# EAGLE design RatDBS-TrackBattery (EAGLE 8.2.2)
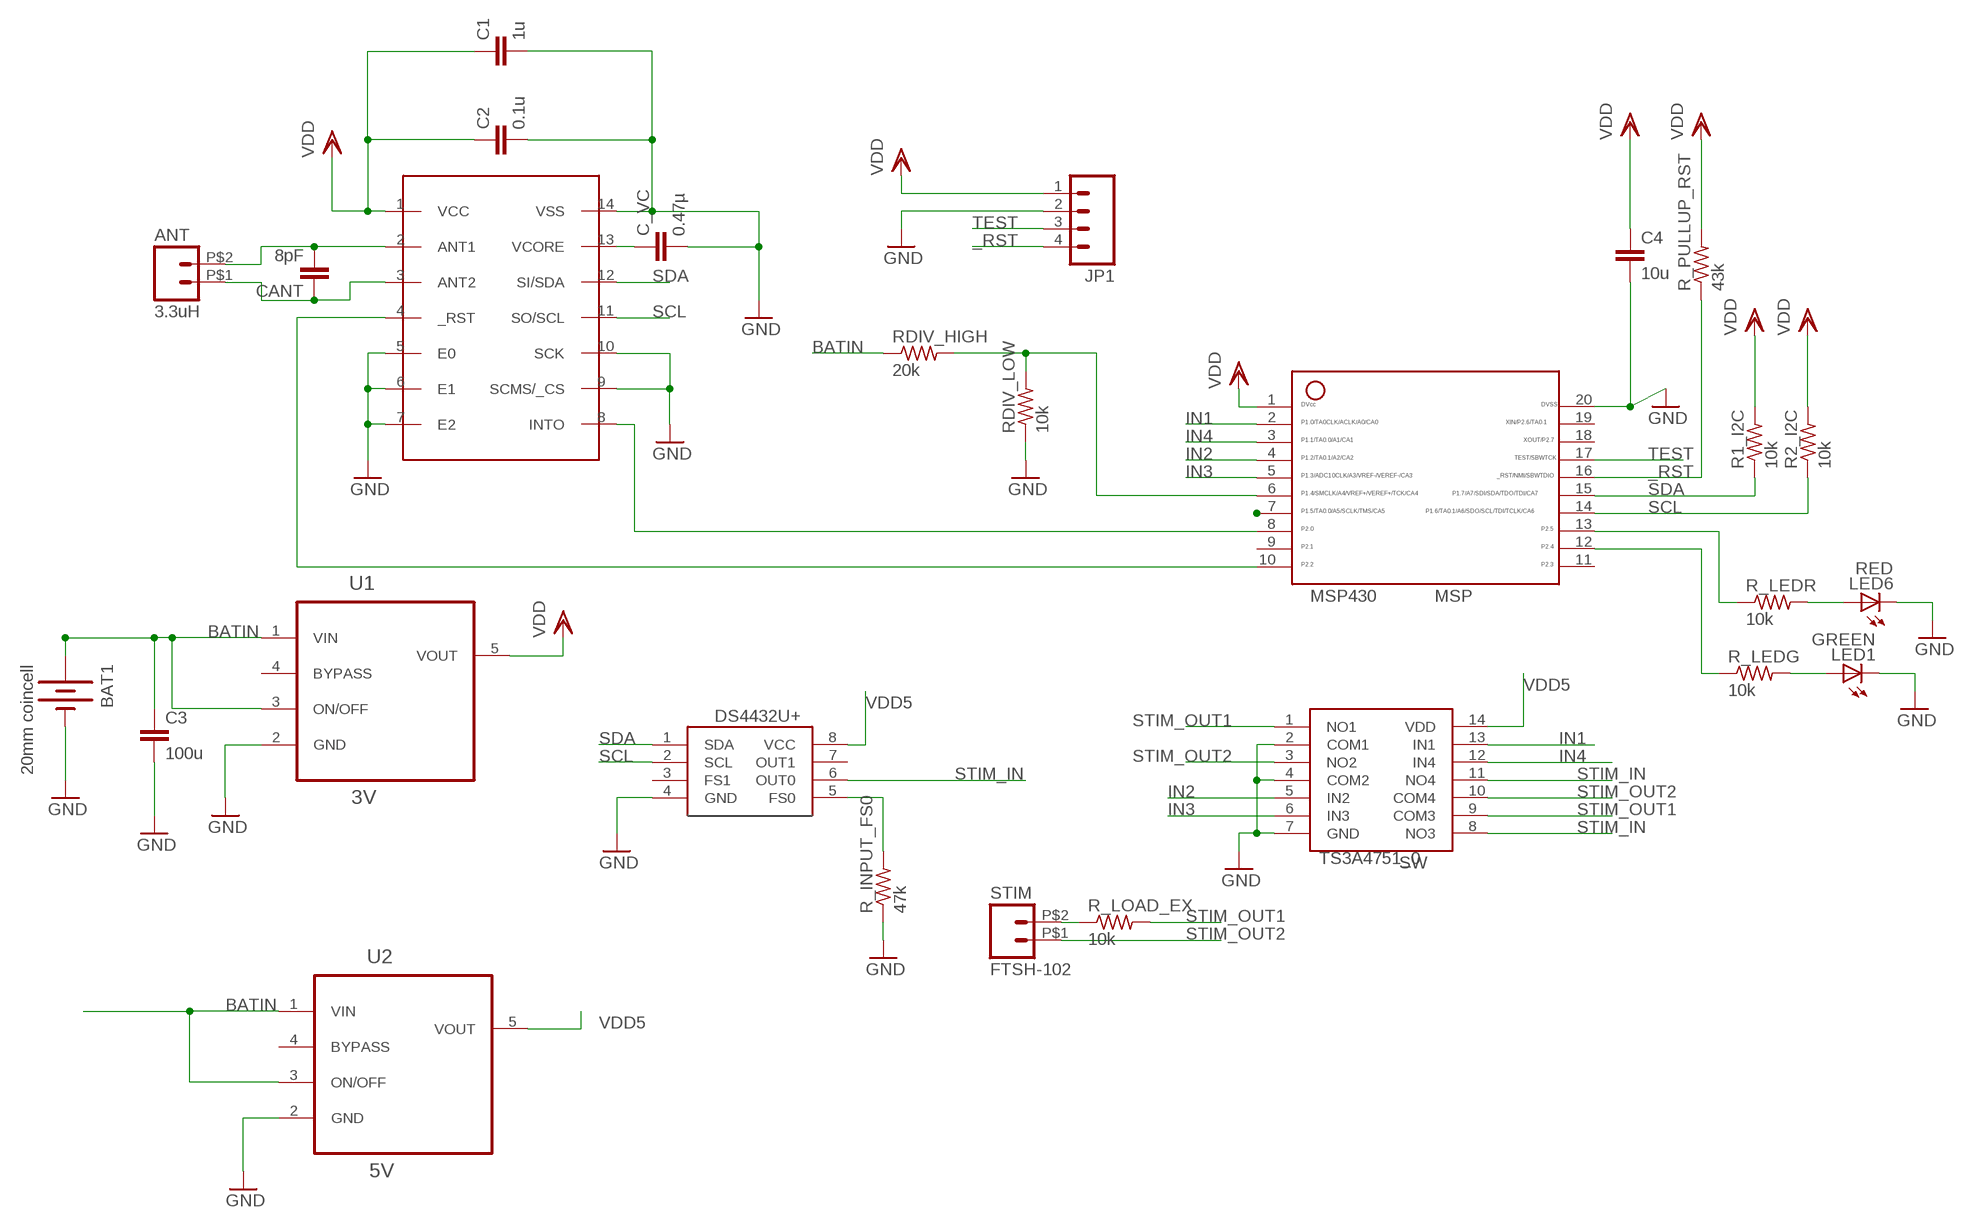
[diagram p0: schematic, sheet 1]

## Parts
ANT  3.3uH  FTSH-102  [FTSH-102-DH]
BAT1  20mm coincell  BATTERY  [BATTCOM_20MM_PLASTIC_STUDS]
C1  1u  C-EUC0603  [C0603]
C2  0.1u  C-EUC0603  [C0603]
C3  100u  C-EUC1206  [C1206]
C4  10u  C-EUC1206  [C1206]
C_VC  0.47µ  C-EUC0603  [C0603]
CANT  8pF  C-EUC0603  [C0603]
DS4432U+  DS4432U+  [8_PIN]
JP1  M041.27MM  [1X04-1.27MM]
LED1  GREEN  LED1206  [LED-1206]
LED6  RED  LED1206  [LED-1206]
MSP430  MSP  MSP430  [20_PIN]
R1_I2C  10k  R-US_R0603  [R0603]
R2_I2C  10k  R-US_R0603  [R0603]
R_INPUT_FS0  47k  R-US_R0603  [R0603]
R_LEDG  10k  R-US_R0603  [R0603]
R_LEDR  10k  R-US_R0603  [R0603]
R_LOAD_EX  10k  R-US_R0603  [R0603]
R_PULLUP_RST  43k  R-US_R0603  [R0603]
RDIV_HIGH  20k  R-US_R0603  [R0603]
RDIV_LOW  10k  R-US_R0603  [R0603]
STIM  FTSH-102  [FTSH-102-DH]
TS3A4751_0  SW  TS3A4751  [14_PIN]
U1  3V  LP2985A-33DBVTE4  [SOT95P280X145-5N]
U2  5V  LP2985A-33DBVTE4  [SOT95P280X145-5N]
U$1  NFC  RF430CL330H  [PW_R-PDSO-G14]

## Nets
_RST: JP1.4 MSP430.16 R_PULLUP_RST.1
BATIN: BAT1.1(+) C3.1 RDIV_HIGH.1 U1.1(VIN) U1.3(ON/OFF) U2.1(VIN) U2.3(ON/OFF)
GND: BAT1.2(-) C1.2 C2.2 C3.2 C4.2 C_VC.2 DS4432U+.4(GND) JP1.2 LED1.C LED6.C MSP430.20 R_INPUT_FS0.1 RDIV_LOW.1 TS3A4751_0.2(COM1) TS3A4751_0.4(COM2) TS3A4751_0.7(GND) U1.2(GND) U2.2(GND) U$1.5(E0) U$1.6(E1) U$1.7(E2) U$1.9(SCMS/_CS) U$1.10(SCK) U$1.14(VSS)
IN1: MSP430.2 TS3A4751_0.13(IN1)
IN2: MSP430.4 TS3A4751_0.5(IN2)
IN3: MSP430.5 TS3A4751_0.6(IN3)
IN4: MSP430.3 TS3A4751_0.12(IN4)
N$1: C_VC.1 U$1.13(VCORE)
N$2: ANT.P$2 CANT.2 U$1.2(ANT1)
N$3: MSP430.8 U$1.8(INTO)
N$4: R_LOAD_EX.1 STIM.P$2
N$5: MSP430.13 R_LEDR.1
N$6: MSP430.7
N$7: MSP430.10 U$1.4(_RST)
N$8: DS4432U+.5(FS0) R_INPUT_FS0.2
N$9: LED6.A R_LEDR.2
N$10: MSP430.6 RDIV_HIGH.2 RDIV_LOW.2
N$11: MSP430.12 R_LEDG.1
N$12: ANT.P$1 CANT.1 U$1.3(ANT2)
N$13: LED1.A R_LEDG.2
SCL: DS4432U+.2(SCL) MSP430.14 R2_I2C.1 U$1.11(SO/SCL)
SDA: DS4432U+.1(SDA) MSP430.15 R1_I2C.1 U$1.12(SI/SDA)
STIM_IN: DS4432U+.6(OUT0) TS3A4751_0.8(NO3) TS3A4751_0.11(NO4)
STIM_OUT1: R_LOAD_EX.2 TS3A4751_0.1(NO1) TS3A4751_0.9(COM3)
STIM_OUT2: STIM.P$1 TS3A4751_0.3(NO2) TS3A4751_0.10(COM4)
TEST: JP1.3 MSP430.17
VDD: C1.1 C2.1 C4.1 JP1.1 MSP430.1 R1_I2C.2 R2_I2C.2 R_PULLUP_RST.2 U1.5(VOUT) U$1.1(VCC)
VDD5: DS4432U+.8(VCC) TS3A4751_0.14(VDD) U2.5(VOUT)
Unconnected: DS4432U+.3(FS1) DS4432U+.7(OUT1) MSP430.9 MSP430.11 MSP430.18 MSP430.19 U1.4(BYPASS) U2.4(BYPASS)

## Library data of the parts
ANT STIM = Samtec50Mil:FTSH-102
BAT1 = Battery:BATTERY: Compact CR2032 Battery Holder SMT ground pad 20MM_4LEGS, Digikey: BAT-HLD-001-THM-OTL
C1-C4 C_VC CANT = rcl:C-EU: CAPACITOR, European symbol
DS4432U+ = RatDBS:DS4432U+: DS4432U+ current DAC
JP1 = SparkFun:M04: Header 4 Standard 4-pin 0.1" header. Use with straight break away headers (SKU : PRT-00116), right angle break away headers (PRT-00553), swiss pins (PRT-00743), machine pins (PRT-00117), and female headers (PRT-00115). Molex polarized connector foot print use with SKU : PRT-08231 with associated crimp pins and housings.
LED1 LED6 = SparkFun-LED:LED: LEDs Standard schematic elements and footprints for 5mm, 3mm, 1206, and 0603 sized LEDs. 5mm - Spark Fun Electronics SKU : COM-00529 (and others)
MSP430 = RatDBS:MSP430: MSP430 20 pins
R1_I2C R2_I2C R_INPUT_FS0 R_LEDG R_LEDR R_LOAD_EX R_PULLUP_RST RDIV_HIGH RDIV_LOW = BiphasicBoard:R-US_: RESISTOR, American symbol
TS3A4751_0 = BiphasicBoard:TS3A4751: TS3A4751 Quad Switch
U1 U2 = Texas Instruments_By_element14_Batch_1:LP2985A-33DBVTE4: 150-mA LOW-NOISE LOW-DROPOUT REGULATOR WITH SHUTDOWN; MPN: LP2985A-33DBVTE4; OC_FARNELL: 1053660; OC_NEWARK: 79K3928; PACKAGE: SOT-23-5; SUPPLIER: Texas Instruments
U$1 = RF430CL330H:RF430CL330H

## Board
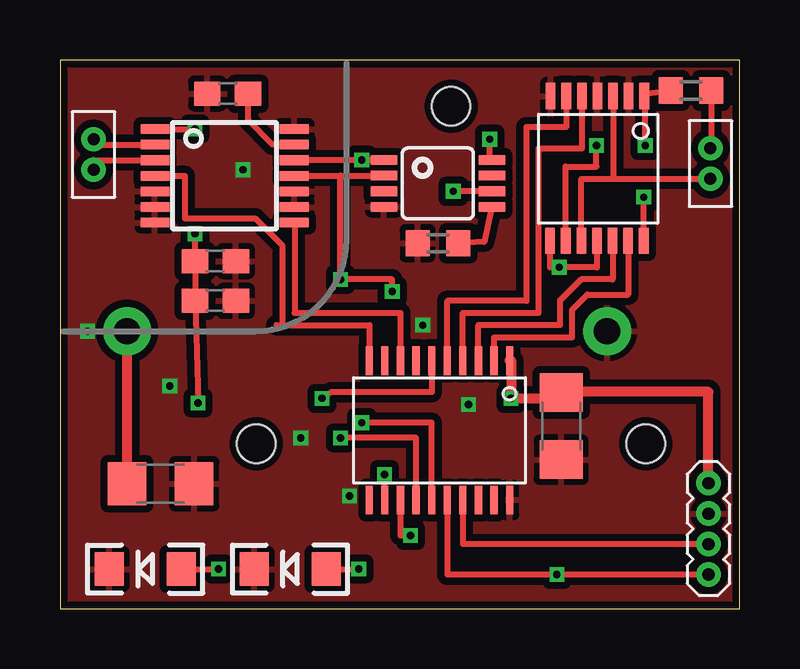
[diagram p1: board, top side]
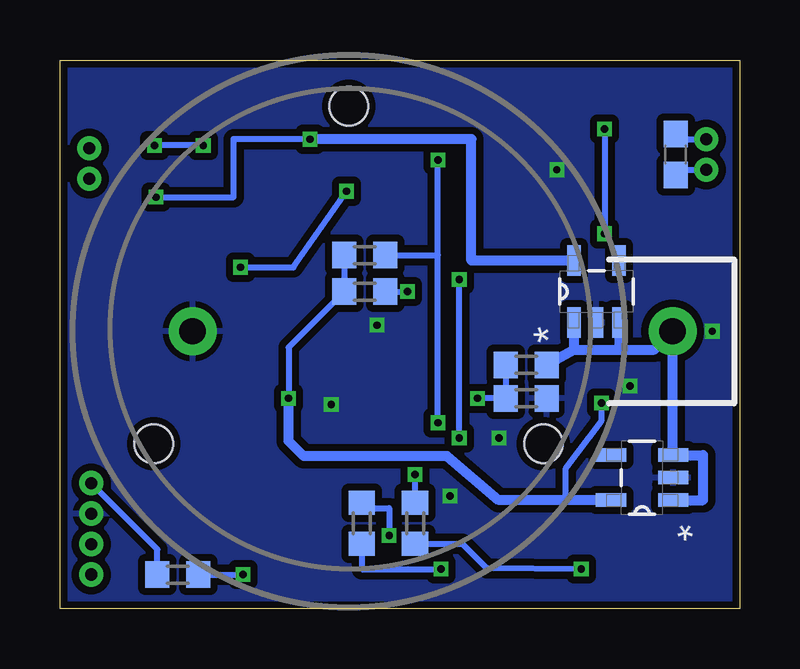
[diagram p2: board, bottom side, seen from below]

Size 28.32 x 22.86 mm. Coordinates in mm from the lower left corner, seen from the top.
Outline: 0,22.86 0,0 28.32,0 28.32,22.86 0,22.86
Copper layers (1*16): Top 0.035mm / dielectric 1.5mm / Bottom 0.035mm
Design rules "Seeed_DRU": minimum track width 6mil, minimum drill 12mil, track to track 6mil, track to pad 6mil, pad to pad 6mil, via to via 6mil, smd to smd 0mil, copper to edge 10mil, drill to drill 10mil, minimum pad ring 10mil, minimum via ring 6mil, stop-mask expansion 2mil, vias tented up to drill 100mil, thermal gap 10mil

### Footprints (pad centres in the part's own frame; a part is rotated, then mirrored left to right if it is on the bottom)
FTSH-102-DH = drill 0.5 pad 1: P$1 -0.635,0; P$2 0.635,0
BATTCOM_20MM_PLASTIC_STUDS = drill 1.1 pad 2: 1 13.5,0; 2 -6.5,0 | hole 1.6: 0,9.37; -8.115,-4.685; 8.115,-4.685
C0603 = smd 1.1 x 1: 1 -0.85,0; 2 0.85,0
C1206 = smd 1.6 x 1.8: 1 -1.4,0; 2 1.4,0
8_PIN = smd 1.1 x 0.4: 1 -2.25,0.975; 2 -2.25,0.325; 3 -2.25,-0.325; 4 -2.25,-0.975; 5 2.25,-0.975; 6 2.25,-0.325; 7 2.25,0.325; 8 2.25,0.975
1X04-1.27MM = drill 0.508 pad 1: 1 0,0; 2 1.27,0; 3 2.54,0; 4 3.81,0
LED-1206 = smd 1.2 x 1.4: A -1.5,0; C 1.5,0
20_PIN = smd 0.3 x 1.2: 1 -2.925,-2.9; 2 -2.275,-2.9; 3 -1.625,-2.9; 4 -0.975,-2.9; 5 -0.325,-2.9; 6 0.325,-2.9; 7 0.975,-2.9; 8 1.625,-2.9; 9 2.275,-2.9; 10 2.925,-2.9; 11 2.925,2.9; 12 2.275,2.9; 13 1.625,2.9; 14 0.975,2.9; 15 0.325,2.9; 16 -0.325,2.9; 17 -0.975,2.9; 18 -1.625,2.9; 19 -2.275,2.9; 20 -2.925,2.9
R0603 = smd 1 x 1.1: 1 -0.85,0; 2 0.85,0
14_PIN = smd 1.1 x 0.4: 1 -3.26,1.165; 2 -3.26,0.515; 3 -3.26,-0.135; 4 -3.26,-0.785; 5 -3.26,-1.435; 6 -3.26,-2.085; 7 -3.26,-2.735; 8 2.77,-2.755; 9 2.77,-2.105; 10 2.77,-1.455; 11 2.77,-0.805; 12 2.77,-0.155; 13 2.77,0.495; 14 2.77,1.145
SOT95P280X145-5N = smd 1.27 x 0.559: 1 -1.295,0.94; 2 -1.295,0; 3 -1.295,-0.94; 4 1.295,-0.94; 5 1.295,0.94
PW_R-PDSO-G14 = smd 0.4 x 1.2: 1 -1.95,-2.9; 2 -1.3,-2.9; 3 -0.65,-2.9; 4 0,-2.9; 5 0.65,-2.9; 6 1.3,-2.9; 7 1.95,-2.9; 8 1.95,2.9; 9 1.3,2.9; 10 0.65,2.9; 11 0,2.9; 12 -0.65,2.9; 13 -1.3,2.9; 14 -1.95,2.9

### Placement (x,y rotation side)
ANT  1.4,18.92 90 top
BAT1  16.29,11.56 0 bottom
C1  6.48,12.83 0 top
C2  6.48,14.48 0 top
C3  4.19,5.21 0 top
C4  20.88,7.61 270 top
C_VC  6.99,21.46 180 top
CANT  2.67,18.92 90 bottom
DS4432U+  15.75,17.72 0 top
JP1  27.02,5.23 270 top
LED1  3.56,1.65 180 top
LED6  9.59,1.65 180 top
MSP430  15.81,7.43 180 top
R1_I2C  15.62,14.73 180 bottom
R2_I2C  15.62,13.21 180 bottom
R_INPUT_FS0  15.75,15.22 0 top
R_LEDG  13.53,3.56 270 bottom
R_LEDR  15.75,3.56 270 bottom
R_LOAD_EX  26.29,21.59 180 top
R_PULLUP_RST  23.41,1.41 180 bottom
RDIV_HIGH  8.89,10.16 180 bottom
RDIV_LOW  8.89,8.76 180 bottom
STIM  27.1,18.54 90 top
TS3A4751_0  23.18,18.1 270 top
U1  4.06,5.46 180 bottom
U2  5.97,13.21 90 bottom
U$1  6.86,18.03 270 top

### Tracks (layer width: path | path; a pad name or v marks a point on that pad's centre or on a via)
_RST  (via drill 0.3)
  Top 0.254: MSP430.16 16.14,1.42 v20.7,1.42 JP1.4
  Bottom 0.254: R_PULLUP_RST.1 v20.7,1.42
BATIN
  Top 0.406: C3.1 BAT1.1
  Bottom 0.406: RDIV_HIGH.1 6.91,10.79 | 6.91,10.79 5.03,10.79 | 5.03,10.79 3.56,10.79 BAT1.1 2.79,6.4 U1.3 1.52,6.4 1.52,4.52 U1.1 | U2.3 5.03,10.79 | U2.1 6.91,10.79
GND  (via drill 0.3)
  other vias: 12.06,4.7 17.02,8.51 7.62,18.29 1.14,11.56 4.57,9.27 15.11,11.81 10.03,7.11
  pour Top (isolate 0.305): 0,0 0,22.86 29.46,22.86 29.46,0
  pour Bottom (isolate 0.305): 0,0 0,22.86 29.46,22.86 29.46,0
IN1
  Top 0.254: MSP430.2 18.09,11.3 21.34,11.3 21.34,12.45 21.97,13.08 23.67,13.08 TS3A4751_0.13
IN2
  Top 0.254: MSP430.4 16.79,12.32 19.94,12.32 19.94,19.18 21.74,19.18 TS3A4751_0.5
IN3
  Top 0.254: TS3A4751_0.6 21.09,20.07 19.43,20.07 19.43,12.83 16.14,12.83 MSP430.5
IN4
  Top 0.254: TS3A4751_0.12 23.02,13.72 21.72,13.72 20.83,12.83 20.83,11.81 17.44,11.81 MSP430.3
N$1
  Top 0.254: U$1.13 8.85,19.33 7.83,20.35 C_VC.1
N$2
  Top 0.254: ANT.P$2 1.4,19.33 U$1.2
  Bottom 0.254: CANT.2 2.67,19.56 ANT.P$2
N$3
  Top 0.254: U$1.8 9.78,16.08 9.78,12.32 14.19,12.32 MSP430.8
N$4
  Top 0.254: R_LOAD_EX.1 27.14,19.18 STIM.P$2
N$5  (via drill 0.3)
  Top 0.254: 14.22,3.05 v14.61,3.05 14.19,3.05 MSP430.13
  Bottom 0.254: R_LEDR.1 15.49,4.19 14.61,4.19 v14.61,3.05
N$7
  Top 0.254: 9.27,11.81 12.89,11.81 MSP430.10 | 9.02,11.81 9.27,11.81 | 9.27,11.81 9.27,15.11 8.13,16.26 5.21,16.26 5.21,18.03 U$1.4
N$8
  Top 0.254: DS4432U+.5 17.67,15.28 R_INPUT_FS0.2
N$9  (via drill 0.3)
  Top 0.254: LED6.A v12.45,1.65
  Bottom 0.254: R_LEDR.2 15.75,1.65 v12.45,1.65
N$10  (via drill 0.3)
  Top 0.254: MSP430.6 15.49,9.02 11.3,9.02 v10.92,8.76
  Bottom 0.254: v10.92,8.76 RDIV_LOW.2 RDIV_HIGH.2
N$11  (via drill 0.3)
  Top 0.254: MSP430.12 13.54,5.71 v13.53,5.59
  Bottom 0.254: R_LEDG.1 v13.53,5.59
N$12
  Top 0.254: ANT.P$1 1.4,18.68 U$1.3
  Bottom 0.254: CANT.1 2.67,18.29 ANT.P$1
N$13  (via drill 0.3)
  Top 0.254: 5.06,1.69 LED1.A v6.6,1.65
  Bottom 0.254: v6.6,1.65 10.54,1.69 11.56,2.71 R_LEDG.2
SCL  (via drill 0.3)
  Top 0.254: MSP430.14 14.84,7.11 v11.68,7.11 | 11.68,18.03 v11.68,13.72 13.84,13.72 v13.84,13.21 | U$1.11 11.68,18.03 | 11.68,18.03 11.68,18.04 | 11.68,18.03 DS4432U+.2
  Bottom 0.254: v11.68,7.11 v11.68,13.72 | R2_I2C.1 v13.84,13.21
SDA  (via drill 0.3)
  Top 0.254: MSP430.15 15.49,7.75 v12.57,7.75 | U$1.12 9.76,18.69 v12.57,18.69 DS4432U+.1
  Bottom 0.254: v12.57,7.75 12.57,14.73 | 12.57,14.73 v12.57,18.69 | R1_I2C.1 12.57,14.73
STIM_IN  (via drill 0.3)
  Top 0.254: TS3A4751_0.11 22.37,14.22 v20.8,14.22 20.42,14.22 TS3A4751_0.8 20.42,15.26 | DS4432U+.6 v16.38,17.39
  Bottom 0.254: v20.8,14.22 18.6,14.22 v16.38,17.39
STIM_OUT1  (via drill 0.3)
  Top 0.254: R_LOAD_EX.2 24.34,21.46 TS3A4751_0.1 24.38,20.72 v24.38,19.3 | TS3A4751_0.9 21.07,18.41 22.35,18.41 v22.35,19.3
  Bottom 0.254: v22.35,19.3 v24.38,19.3
STIM_OUT2
  Top 0.254: TS3A4751_0.3 23.04,17.91 | 23.04,17.91 STIM.P$1 | TS3A4751_0.10 21.72,17.91 23.04,17.91
TEST
  Top 0.254: MSP430.17 16.79,2.69 JP1.3
VDD  (via drill 0.3)
  Top 0.254: U$1.1 v5.63,19.98 | 20.88,9.04 C4.1 | v5.75,8.57 C1.1 C2.1 v5.63,15.62
  Top 0.406: MSP430.1 18.8,10.33 v18.8,8.76 20.88,8.76 C4.1 | JP1.1 27.02,9.04 20.88,9.04
  Bottom 0.254: v5.63,19.98 v5.63,15.62 | R1_I2C.2 R2_I2C.2 18.8,10.88 v18.8,8.76 | 7.24,4.52 7.24,5.84 5.75,7.83 v5.75,8.57 | R_PULLUP_RST.2 24.26,2.47 JP1.1
  Bottom 0.406: v18.8,8.76 18.8,6.99 18.16,6.35 12.19,6.35 10.03,4.52 7.24,4.52 U1.5
VDD5  (via drill 0.3)
  Top 0.254: TS3A4751_0.14 v24.32,17.14 | DS4432U+.8 17.91,18.69 v17.91,19.56
  Bottom 0.254: v24.32,17.14 21.08,17.14 21.08,19.56 v17.91,19.56
  Bottom 0.406: v17.91,19.56 11.18,19.56 11.18,14.5 U2.5

### Text on the board
tValues: RTGV
tDocu: STIM
bDocu: NFC-RDBS / Kemere Lab / v3.0 (C)2017